# EasyEDA Pro project ProPrj_STM32F103ZET6_2025-04-15.epro, board STM32_PCB
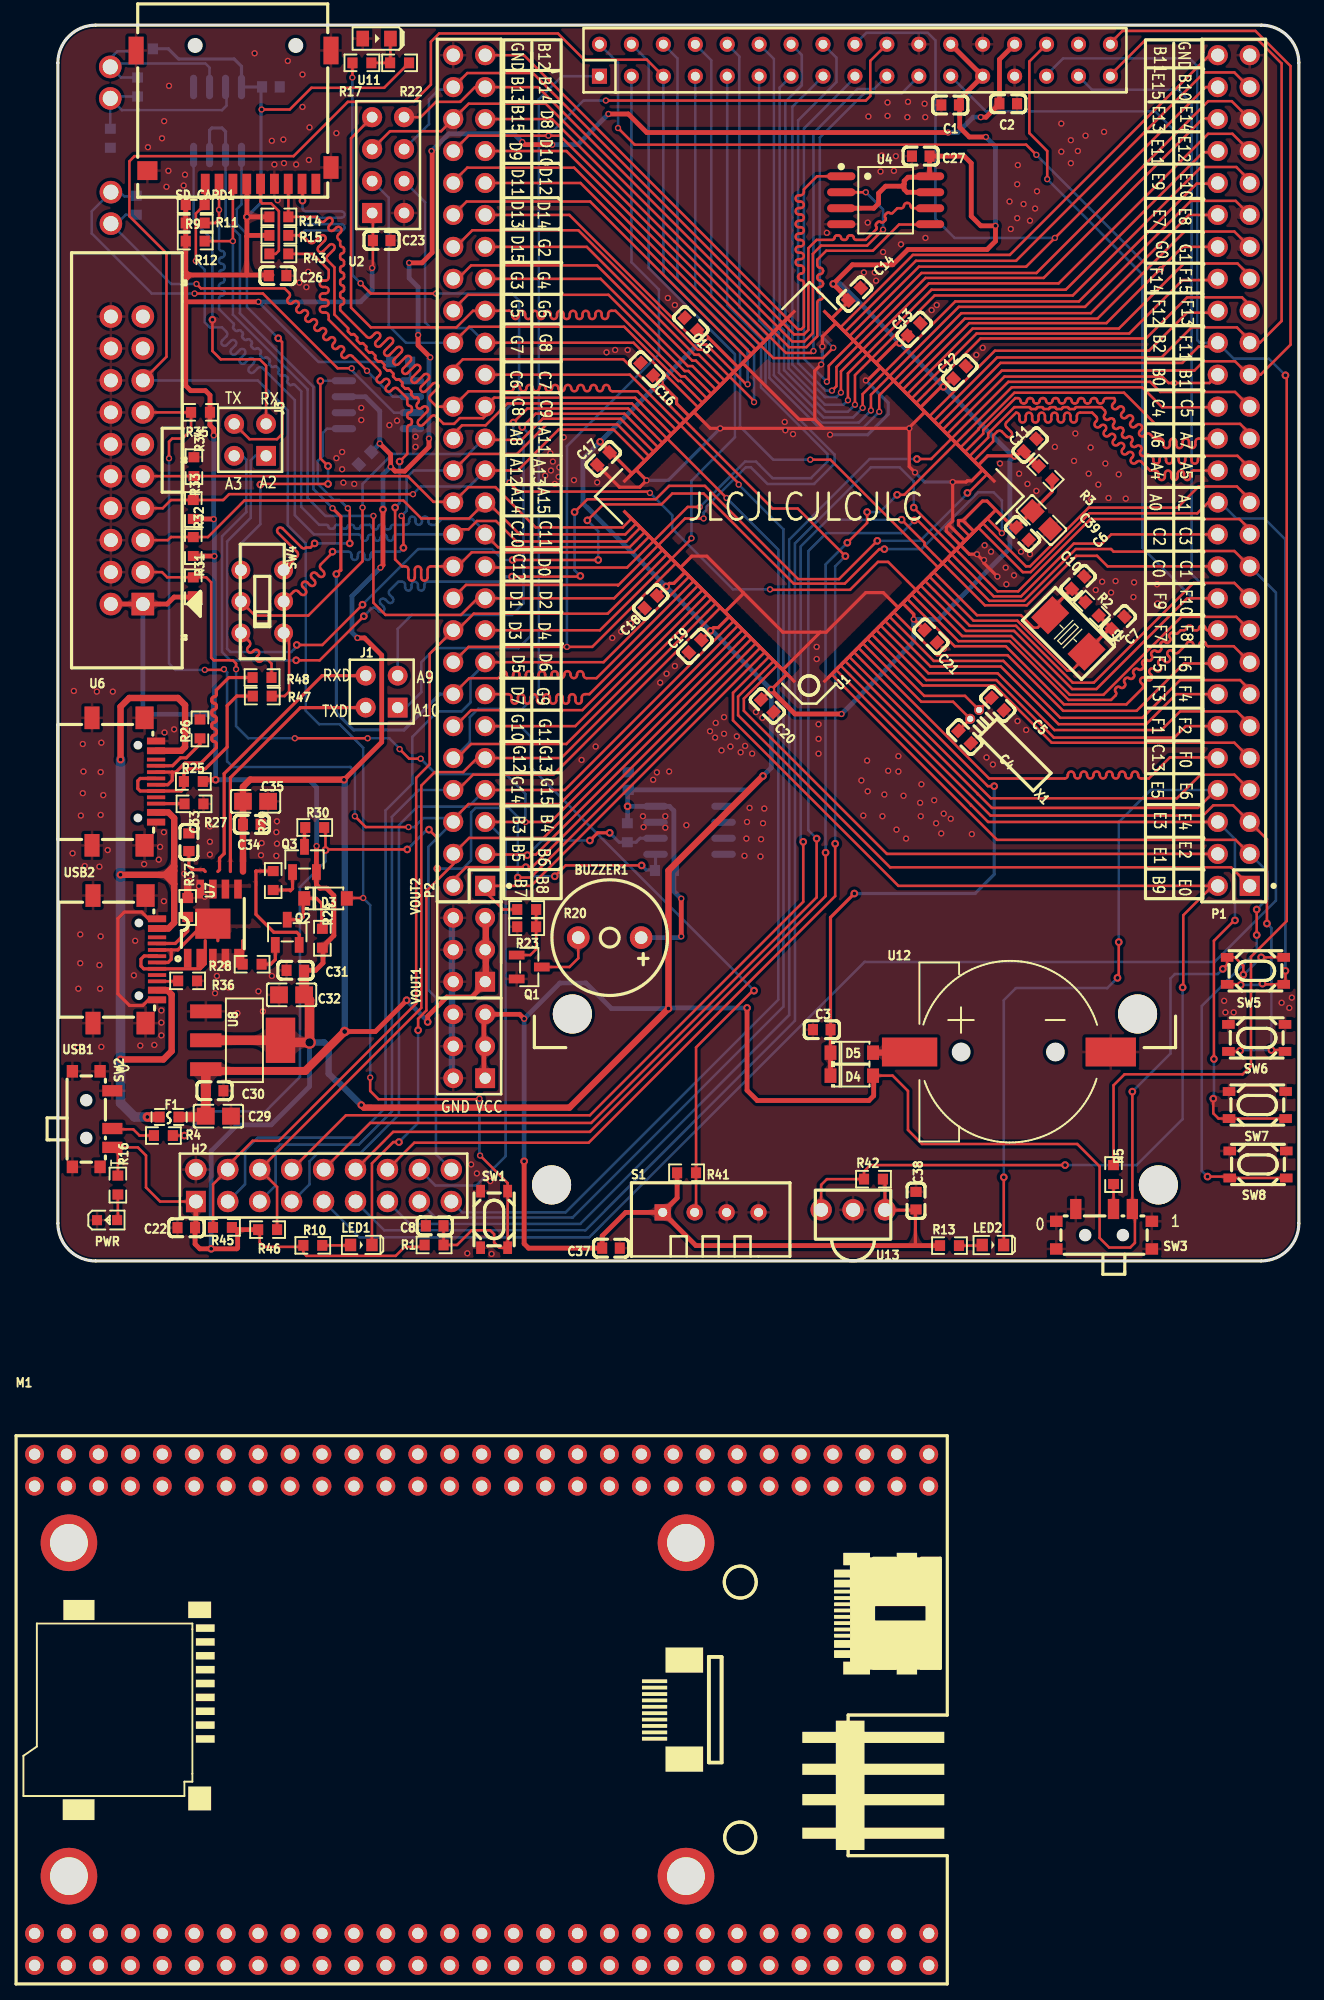
[diagram p6: board, top side]
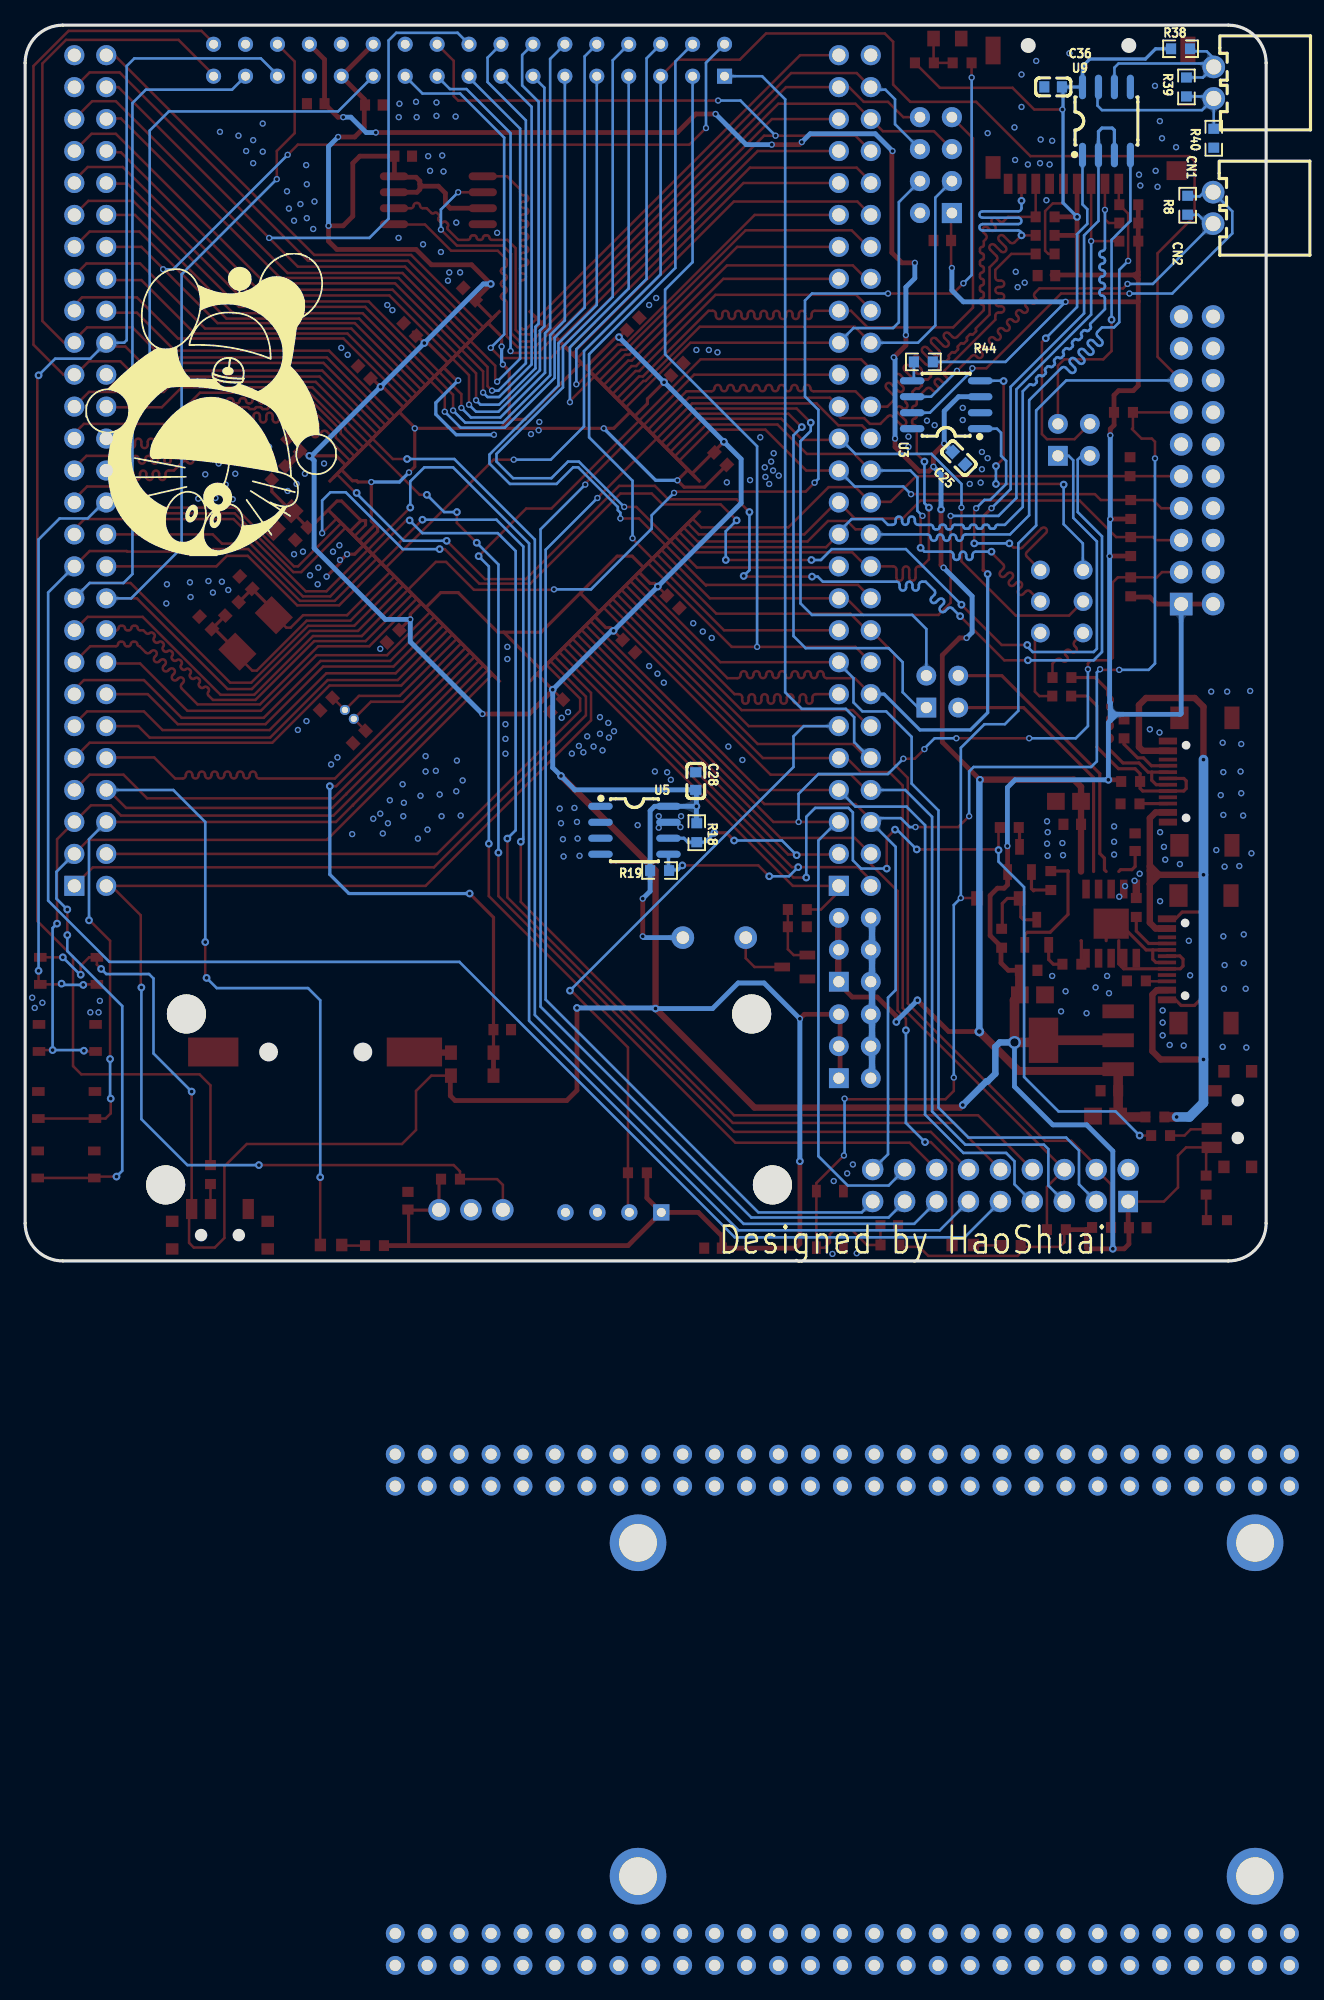
[diagram p7: board, bottom side, seen from below]

Outline 98.7 x 98.25 mm; copper layers: Top Layer, Bottom Layer. Coordinates in mm from the lower left corner of the outline.
Outline path: 0,95.25 0,3 arc(0.88,0.88) 3,0 95.7,0 arc(97.83,0.88) 98.7,3 98.7,95.25 arc(97.83,97.37) 95.7,98.25 3,98.25 arc(0.88,97.37) 0,95.25
Stack: Top Layer 0.035mm - / Dielectric1 1.51mm FR4 er 4.5 / Bottom Layer 0.035mm -

## Design rules (mm)
net PA2: DP4
net PA3: DP4
net PA11: DP3
net PA12: DP3
net D+: DP1
net D-: DP1
net CAN_TX: DP5
net CAN_RX: DP5
net $3N74: DP6
net $3N75: DP6
net $3N43: DP2
net $3N40: DP2
template: JLCPCB Capability(Two Layers Board)
spacing copperThickness1oz (default): track to track 0.102, other pairs 0.152 to 0.3
spacing copperThickness2oz: track to track 0.203, other pairs 0.152 to 0.3
track width copperThickness1oz (default): min 0.127, default 0.254, max 2.54
track width copperThickness2oz: min 0.203, default 0.254, max 2.54
differential pair differentialPair (default): width min 0.127, default 0.254, max 2.54; gap min 0.152, default 0.152
via viaSize (default): diameter min 0.5, default 0.61, max 10; hole min 0.3, default 0.305, max 6.3

## Placement (name value [footprint] x y rotation side)
1  TFTLCD  [TFTLCD_2_4/2_8/3_5]  63.4 51.51 0 top
BUZZER1  3kHz  [BUZ-TH_BD9.0-P5.00-D0.6-FD]  43.89 25.7 180 top
C1  104  [C0603]  70.97 91.9 180 top
C2  104  [C0603]  75.59 92 0 top
C3  104  [C0603]  60.76 18.39 180 top
C4  10P  [C0603]  72.13 41.65 135 top
C5  10P  [C0603]  74.75 44.28 135 top
C6  22P  [C0603]  81.14 53.93 225 top
C7  22P  [C0603]  84.34 50.73 225 top
C8  104  [C0603]  29.97 2.79 180 top
C10  104  [C0603]  76.72 57.82 135 top
C11  0.1u  [C0603]  77.33 64.86 225 top
C12  0.1u  [C0603]  71.73 70.64 225 top
C13  0.1u  [C0603]  68.1 74.05 225 top
C14  0.1u  [C0603]  63.37 76.86 225 top
C15  0.1u  [C0603]  50.35 74.49 315 top
C16  0.1u  [C0603]  46.84 70.89 315 top
C17  0.1u  [C0603]  43.39 63.78 45 top
C18  0.1u  [C0603]  47.16 52.39 45 top
C19  0.1u  [C0603]  50.68 48.87 45 top
C20  0.1u  [C0603]  56.43 44.13 135 top
C21  0.1u  [C0603]  69.43 49.66 135 top
C22  104  [C0603]  10.21 2.64 180 top
C23  104  [C0603]  25.76 81.13 0 top
C25  104  [C0603]  24.44 63.82 225 bottom
C26  104  [C0603]  17.48 78.33 0 top
C27  104  [C0603]  68.63 87.83 0 top
C28  104  [C0603]  45.36 38.15 270 bottom
C29  10u  [C0805]  12.77 11.51 180 top
C30  104  [C0603]  12.47 13.53 0 top
C31  104  [C0603]  18.89 23.11 180 top
C32  10u  [C0805]  18.59 21.15 0 top
C33  104  [C0603]  10.42 33.29 270 top
C34  104  [C0603]  15.42 34.71 180 top
C35  10u  [C0805]  15.72 36.54 0 top
C36  104  [C0603]  16.94 93.34 0 bottom
C37  104  [C0603]  43.99 1.02 180 top
C38  104  [C0603]  68.26 4.79 90 top
C39  10uF  [C0805]  78.23 58.9 315 top
CN1  RS485  [CONN-TH_2P-P2.50_XH-2AW]  4.17 93.68 270 bottom
CN2  CAN  [CONN-TH_2P-P2.50_XH-2AW]  4.22 83.72 270 bottom
D3  1N4148W  [SOD-123_L2.8-W1.8-LS3.7-RD]  21.29 28.82 0 top
D4  DSS14  [SOD-123_L2.8-W1.8-LS3.7-RD]  63.14 14.73 0 top
D5  DSS14  [SOD-123_L2.8-W1.8-LS3.7-RD]  63.14 16.56 0 top
F1  6V1A  [F0603]  8.84 11.45 0 top
H2  OV7670  [HDR-TH_18P-P2.54-V-F-R2-C9-S2.54-1]  21.13 5.99 0 top
J1  USART1  [HDR-M-2.54_2X2]  25.76 45.26 180 top
J3  USART2  [HDR-M-2.54_2X2]  15.29 65.28 180 top
LED1  LED-0603_G  [LED0603_GREEN]  24.13 1.27 0 top
LED2  LED-0603_B  [LED0603_BLUE]  74.37 1.27 0 top
M1  FK103M5  [zet60.11]  -4.77 -59.44 0 top
P1  X6521WV-2×27H-C30D60  [HDR-TH_54P-2.54-V-M-R2-C27-S2.54]  93.52 62.84 90 top
P2  X6521WV-2×27H-C30D60  [HDR-TH_54P-2.54-V-M-R2-C27-S2.54]  32.71 62.84 90 top
PWR  -  [LED_0603]  3.96 3.25 0 top
Q1  SS8050  [SOT-23-3_L2.9-W1.3-P1.90-LS2.4-BR]  37.49 23.37 180 top
Q2  SS8050  [SOT-23-3_L2.9-W1.3-P1.90-LS2.4-BR]  18.24 26.13 270 top
Q3  SS8550  [SOT-23-3_L2.9-W1.3-P1.90-LS2.4-BR]  19.61 31.92 270 top
R1  10K  [R0603]  29.92 1.27 180 top
R2  1M  [R0603]  82.25 51.84 315 top
R3  10R  [R0603]  78.55 62.64 135 top
R4  10K  [R0603]  8.39 9.97 180 top
R5  10K  [R0603]  83.96 6.87 270 top
R8  120R  [R0603]  6.24 83.93 270 bottom
R9  47K  [R0603]  10.92 83.97 180 top
R10  510  [R0603]  20.27 1.24 180 top
R11  47K  [R0603]  10.92 82.52 180 top
R12  47K  [R0603]  10.92 81.08 180 top
R13  510  [R0603]  70.92 1.22 0 top
R14  47K  [R0603]  17.58 83.01 180 top
R15  47K  [R0603]  17.58 81.53 180 top
R16  510  [R0603]  4.77 6.03 270 top
R17  1K  [R0603]  24.18 95.25 0 top
R18  4.7K  [R0603]  45.29 34.05 90 bottom
R19  4.7K  [R0603]  48.24 31.04 0 bottom
R20  1K  [R0603]  37.29 27.94 0 top
R22  47K  [R0603]  27.18 95.25 0 top
R23  10K  [R0603]  37.29 26.57 180 top
R24  10K  [R0603]  21.04 25.65 270 top
R25  1.5K  [R0603]  10.78 38.12 180 top
R26  4.7k  [R0603]  11.3 42.3 270 top
R27  4.7k  [R0603]  10.83 36.34 180 top
R28  1K  [R0603]  15.45 23.59 180 top
R29  1K  [R0603]  17.12 30.24 90 top
R30  1K  [R0603]  20.43 34.46 180 top
R31  10k  [R0603]  10.77 53.59 90 top
R32  10k  [R0603]  10.77 56.79 90 top
R33  10k  [R0603]  10.77 59.74 90 top
R34  10k  [R0603]  10.82 63.14 270 top
R35  10k  [R0603]  11.35 67.46 180 top
R36  4.7k  [R0603]  10.32 22.27 180 top
R37  4.7k  [R0603]  10.33 28.1 270 top
R38  360  [R0603]  6.81 96.37 180 bottom
R39  120  [R0603]  6.34 93.33 270 bottom
R40  360  [R0603]  4.17 89.26 270 bottom
R41  4.7k  [R0603]  50 7.01 180 top
R42  4.7k  [R0603]  64.87 6.5 0 top
R43  100  [R0603]  17.58 80.06 180 top
R44  510  [R0603]  27.26 71.48 0 bottom
R45  4.7k  [R0603]  13.09 2.66 0 top
R46  4.7k  [R0603]  16.68 2.49 180 top
R47  10  [R0603]  16.26 44.91 0 top
R48  10  [R0603]  16.24 46.38 180 top
S1  DHT11_C87032  [SENSOR-TH_DHT11-1]  51.92 3.86 0 top
SD_CARD1  THD2528-11SD-GF  [TF-SMD_THD2528-11SD-GF]  13.97 90.93 180 top
SW1  RST  [SW-SMD_4P-L4.2-W3.2-P2.15-LS4.6]  34.7 3.3 90 top
SW2  BOOT0  [CONN-TH_TA-3524A-A2]  2.74 11.28 90 top
SW3  BOOT1  [CONN-TH_TA-3524A-A2]  83.21 2.54 180 top
SW4  USB/CAN  [SW-TH_6P-L9.1-W3.5-P2.50]  16.26 52.43 270 top
SW5  KEY_UP  [SW-SMD_4P-L4.2-W3.2-P2.15-LS4.6]  95.25 23.06 0 top
SW6  KEY0  [SW-SMD_4P-L4.2-W3.2-P2.15-LS4.6]  95.35 17.73 0 top
SW7  KEY1  [SW-SMD_4P-L4.2-W3.2-P2.15-LS4.6]  95.4 12.4 0 top
SW8  KEY2  [SW-SMD_4P-L4.2-W3.2-P2.15-LS4.6]  95.45 7.67 0 top
U1  STM32F103ZET6  [LQFP144]  61.53 46.65 135 top
U2  -  [NF-01-S]  26.26 87.12 90 top
U3  TJA1050  [SOIC-8_L5.0-W4.0-P1.27-LS6.0-BL]  25.45 68.07 90 bottom
U4  W25Q128  [SOIC-8_L5.3-W5.3-P1.27-LS8.0-BL]  65.84 84.33 270 top
U5  AT24C02  [SOIC-8_L5.0-W4.0-P1.27-LS6.0-BL]  50.24 34.24 270 bottom
U6  JTAG_20  [IDC-TH_20P-P2.54_SAMTEC-HTST-110-01-X-D]  5.49 63.65 90 top
U7  CH340K  [CH340K中央焊盘修改]  13.72 28.21 0 top
U8  AMS1117-3.3_C2992570  [SOT-223-3_L6.4-W3.5-P2.30-LS7.0-BR]  14.74 17.54 180 top
U9  TP8485E-SR  [SOIC-8_L5.0-W4.0-P1.27-LS6.0-BL]  12.7 90.63 180 bottom
U11  0805-PTSM D021  [OPTO-SMD_L2.0-W1.3-RD]  25.35 97.18 180 top
U12  CR1220-A  [BAT-SMD_CR1220-2]  75.74 16.61 0 top
U13  HS0038B  [OPTO-TH_HS0038B-A]  63.25 4.06 180 top
USB1  USB-TTL  [USB-C-SMD_TYPEC-304S-ACP16]  5.34 23.98 270 top
USB2  USB-OTG  [USB-C-SMD_TYPEC-304S-ACP16]  5.26 38.11 270 top
VOUT1  VCC3.3  [HDR-M-2.54_2X3]  33.98 14.53 90 top
VOUT2  VCC5  [HDR-M-2.54_2X3]  33.98 22.2 90 top
X1  32.768KHZ  [OSC-TH_BD2.0-P0.70-D0.3]  72.92 43.45 135 top
X2  8MHz  [CRYSTAL-SMD_L5.0-W3.2]  80.37 49.89 315 top

## Footprints (pads in the part's own frame, mm; a bottom-side part is the same pattern mirrored in y, then rotated)
BAT-SMD_CR1220-2
  rect 4.4x2.3 smd: 1(-8,0)
  rect 4x2.3 smd: 2(8,0)
BUZ-TH_BD9.0-P5.00-D0.6-FD
  round 1.8 hole 1: 1(-2.5,0) 2(2.5,0)
C0603
  rect 0.8x0.9 smd: 1(-0.7,0) 2(0.7,0)
C0805
  rect 1.41x1.35 smd: 1(-1,0) 2(1,0)
CH340K中央焊盘修改
  rect 0.6x1.5 smd: 1(-3.397,-4.147) 2(-2.397,-4.147) 3(-1.397,-4.147) 4(-0.397,-4.147) 5(0.603,-4.147) 6(0.603,1.353) 7(-0.397,1.353) 8(-1.397,1.353) 9(-2.397,1.353) 10(-3.397,1.353)
  rect 2.8x2.4 smd: 11(-1.397,-1.397)
CONN-TH_2P-P2.50_XH-2AW
  round 1.8 hole 1.199: 1(-1.251,0) 2(1.251,0)
CONN-TH_TA-3524A-A2
  rect 0.9x1.6 smd: 1(-2.25,-1.587) 2(-0.75,-1.587) 3(2.25,-1.587)
  rect 1x0.9 smd: 4(-3.8,-0.613) 5(-3.8,1.587) 6(3.8,-0.613) 7(3.8,1.587)
CRYSTAL-SMD_L5.0-W3.2
  rect 1.9x2.4 smd: 1(-2.05,0) 2(2.05,0)
F0603
  rect 0.806x0.864 smd: 1(-0.753,0) 2(0.753,0)
HDR-M-2.54_2X2
  rect 1.575x1.575 hole 0.889: 1(-1.27,1.27)
  round 1.575 hole 0.889: 2(1.27,1.27) 3(-1.27,-1.27) 4(1.27,-1.27)
HDR-M-2.54_2X3
  rect 1.575x1.575 hole 0.889: 1(0,0)
  round 1.575 hole 0.889: 2(0,2.54) 3(2.54,0) 4(2.54,2.54) 5(5.08,0) 6(5.08,2.54)
HDR-TH_18P-P2.54-V-F-R2-C9-S2.54-1
  rect 1.575x1.7 hole 1.1: 1(-10.16,-1.27)
  round 1.7 hole 1.1: 2(-10.16,1.27) 3(-7.62,-1.27) 4(-7.62,1.27) 5(-5.08,-1.27) 6(-5.08,1.27) 7(-2.54,-1.27) 8(-2.54,1.27) 9(0,-1.27) 10(0,1.27) 11(2.54,-1.27) 12(2.54,1.27) 13(5.08,-1.27) 14(5.08,1.27) 15(7.62,-1.27) 16(7.62,1.27) 17(10.16,-1.27) 18(10.16,1.27)
HDR-TH_54P-2.54-V-M-R2-C27-S2.54
  rect 1.6x1.6 hole 1.05: 1(-33.02,-1.27)
  round 1.6 hole 1.05: 2(-33.02,1.27) 3(-30.48,-1.27) 4(-30.48,1.27) 5(-27.94,-1.27) 6(-27.94,1.27) 7(-25.4,-1.27) 8(-25.4,1.27) 9(-22.86,-1.27) 10(-22.86,1.27) 11(-20.32,-1.27) 12(-20.32,1.27) 13(-17.78,-1.27) 14(-17.78,1.27) 15(-15.24,-1.27) 16(-15.24,1.27) 17(-12.7,-1.27) 18(-12.7,1.27) 19(-10.16,-1.27) 20(-10.16,1.27) 21(-7.62,-1.27) 22(-7.62,1.27) 23(-5.08,-1.27) 24(-5.08,1.27) 25(-2.54,-1.27) 26(-2.54,1.27) 27(0,-1.27) 28(0,1.27) 29(2.54,-1.27) 30(2.54,1.27) 31(5.08,-1.27) 32(5.08,1.27) 33(7.62,-1.27) 34(7.62,1.27) 35(10.16,-1.27) 36(10.16,1.27) 37(12.7,-1.27) 38(12.7,1.27) 39(15.24,-1.27) 40(15.24,1.27) 41(17.78,-1.27) 42(17.78,1.27) 43(20.32,-1.27) 44(20.32,1.27) 45(22.86,-1.27) 46(22.86,1.27) 47(25.4,-1.27) 48(25.4,1.27) 49(27.94,-1.27) 50(27.94,1.27) 51(30.48,-1.27) 52(30.48,1.27) 53(33.02,-1.27) 54(33.02,1.27)
IDC-TH_20P-P2.54_SAMTEC-HTST-110-01-X-D
  rect 1.8x1.8 hole 1.1: 1(-11.43,-1.27)
  round 1.8 hole 1.1: 2(-11.43,1.27) 3(-8.89,-1.27) 4(-8.89,1.27) 5(-6.35,-1.27) 6(-6.35,1.27) 7(-3.81,-1.27) 8(-3.81,1.27) 9(-1.27,-1.27) 10(-1.27,1.27) 11(1.27,-1.27) 12(1.27,1.27) 13(3.81,-1.27) 14(3.81,1.27) 15(6.35,-1.27) 16(6.35,1.27) 17(8.89,-1.27) 18(8.89,1.27) 19(11.43,-1.27) 20(11.43,1.27)
LED0603_BLUE
  rect 0.9x1 smd: 1(-0.85,0) 2(0.85,0)
LED0603_GREEN
  rect 0.9x1 smd: 1(-0.85,0) 2(0.85,0)
LED_0603
  rect 0.8x0.8 smd: 1(-0.851,-0.01) 2(0.75,-0.005)
LQFP144
  custom 0.254x1.8 smd: 1(-0.009,0.001) 2(-0.009,-0.499) 3(-0.009,-1) 4(-0.009,-1.5) 5(-0.009,-2) 6(-0.009,-2.499) 7(-0.009,-2.999) 8(-0.009,-3.499) 9(-0.009,-4) 10(-0.009,-4.5) 11(-0.009,-5) 12(-0.009,-5.5) 13(-0.009,-6) 14(-0.009,-6.5) 15(-0.009,-7) 16(-0.009,-7.5) 17(-0.009,-8) 18(-0.009,-8.499) 19(-0.009,-8.999) 20(-0.009,-9.499) 21(-0.009,-9.999) 22(-0.009,-10.499) 23(-0.009,-10.999) 24(-0.009,-11.499) 25(-0.009,-11.999) 26(-0.009,-12.499) 27(-0.009,-13) 28(-0.009,-13.499) 29(-0.009,-13.999) 30(-0.009,-14.499) 31(-0.009,-14.999) 32(-0.009,-15.5) 33(-0.009,-15.999) 34(-0.009,-16.5) 35(-0.009,-17) 36(-0.009,-17.5) 73(22.491,-17.5) 74(22.491,-17) 75(22.491,-16.499) 76(22.491,-15.999) 77(22.491,-15.499) 78(22.491,-14.999) 79(22.491,-14.499) 80(22.491,-13.999) 81(22.491,-13.499) 82(22.491,-12.999) 83(22.491,-12.499) 84(22.491,-11.999) 85(22.491,-11.499) 86(22.491,-10.999) 87(22.491,-10.499) 88(22.491,-9.999) 89(22.491,-9.499) 90(22.491,-8.999) 91(22.491,-8.499) 92(22.491,-8) 93(22.491,-7.499) 94(22.491,-7) 95(22.491,-6.5) 96(22.491,-6) 97(22.491,-5.5) 98(22.491,-5) 99(22.491,-4.5) 100(22.491,-3.999) 101(22.491,-3.499) 102(22.491,-2.999) 103(22.491,-2.499) 104(22.491,-2) 105(22.491,-1.5) 106(22.491,-1) 107(22.491,-0.499) 108(22.491,0.001)
  custom 1.8x0.254 smd: 37(2.491,-20) 38(2.991,-20) 39(3.491,-20) 40(3.991,-20) 41(4.491,-20) 42(4.991,-20) 43(5.491,-20) 44(5.991,-20) 45(6.491,-20) 46(6.991,-20) 47(7.491,-20) 48(7.991,-20) 49(8.491,-20) 50(8.991,-20) 51(9.491,-20) 52(9.991,-20) 53(10.491,-20) 54(10.991,-20) 55(11.491,-20) 56(11.991,-20) 57(12.491,-20) 58(12.991,-20) 59(13.491,-20) 60(13.991,-20) 61(14.491,-20) 62(14.991,-20) 63(15.491,-20) 64(15.991,-20) 65(16.491,-20) 66(16.991,-20) 67(17.491,-20) 68(17.991,-20) 69(18.491,-20) 70(18.991,-20) 71(19.491,-20) 72(19.991,-20) 109(19.991,2.501) 110(19.491,2.501) 111(18.991,2.501) 112(18.491,2.501) 113(17.991,2.501) 114(17.491,2.501) 115(16.991,2.501) 116(16.491,2.501) 117(15.991,2.501) 118(15.491,2.501) 119(14.991,2.501) 120(14.491,2.501) 121(13.991,2.501) 122(13.491,2.501) 123(12.991,2.501) 124(12.491,2.501) 125(11.991,2.501) 126(11.491,2.501) 127(10.991,2.501) 128(10.491,2.501) 129(9.991,2.501) 130(9.491,2.501) 131(8.991,2.501) 132(8.491,2.501) 133(7.991,2.501) 134(7.491,2.501) 135(6.991,2.501) 136(6.491,2.501) 137(5.991,2.501) 138(5.491,2.501) 139(4.991,2.501) 140(4.491,2.501) 141(3.991,2.501) 142(3.491,2.501) 143(2.991,2.501) 144(2.491,2.501)
NF-01-S
  rect 1.6x1.6 hole 0.85: 1(-3.81,1.27)
  round 1.6 hole 0.85: 2(-3.81,-1.27) 3(-1.27,1.27) 4(-1.27,-1.27) 5(1.27,1.27) 6(1.27,-1.27) 7(3.81,1.27) 8(3.81,-1.27)
OPTO-SMD_L2.0-W1.3-RD
  rect 1x1.25 smd: 1(-1.1,0) 2(1.1,0)
OPTO-TH_HS0038B-A
  round 1.7 hole 1.1: 1(2.54,0) 2(0,0) 3(-2.54,0)
OSC-TH_BD2.0-P0.70-D0.3
  round 0.8 hole 0.5: 1(0,0.5) 2(0,-0.5)
R0603
  rect 0.806x0.864 smd: 1(-0.753,0) 2(0.753,0)
SENSOR-TH_DHT11-1
  rect 1.296x1.296 hole 0.711: 1(-3.81,0)
  round 1.296 hole 0.711: 2(-1.27,0) 3(1.27,0) 4(3.81,0)
SOD-123_L2.8-W1.8-LS3.7-RD
  rect 0.95x1.15 smd: 1(-1.692,0) 2(1.692,0)
SOIC-8_L5.0-W4.0-P1.27-LS6.0-BL
  oval 0.569x1.95 smd: 1(-1.905,-2.705) 2(-0.635,-2.705) 3(0.635,-2.705) 4(1.905,-2.705) 5(1.905,2.705) 6(0.635,2.705) 7(-0.635,2.705) 8(-1.905,2.705)
SOIC-8_L5.3-W5.3-P1.27-LS8.0-BL
  oval 0.63x2.25 smd: 1(-1.905,-3.53) 2(-0.635,-3.53) 3(0.635,-3.53) 4(1.905,-3.53) 5(1.905,3.53) 6(0.635,3.53) 7(-0.635,3.53) 8(-1.905,3.53)
SOT-23-3_L2.9-W1.3-P1.90-LS2.4-BR
  rect 1.25x0.7 smd: 1(1,-0.95) 2(1,0.95) 3(-1,0)
SOT-223-3_L6.4-W3.5-P2.30-LS7.0-BR
  rect 2.5x1.1 smd: 1(2.97,-2.3) 2(2.97,0) 3(2.97,2.3)
  rect 2.34x3.6 smd: 4(-2.97,0)
SW-SMD_4P-L4.2-W3.2-P2.15-LS4.6
  rect 1x0.7 smd: 1(-2.25,1.075) 2(2.25,1.075) 3(-2.25,-1.075) 4(2.25,-1.075)
SW-TH_6P-L9.1-W3.5-P2.50
  round 1.5 hole 0.95: 1(-2.5,-1.7) 2(0,-1.7) 3(2.5,-1.7) 4(2.5,1.7) 5(0,1.7) 6(-2.5,1.7)
TF-SMD_THD2528-11SD-GF
  rect 0.7x1.6 smd: 1(2.25,5.3) 2(1.15,5.3) 3(0.05,5.3) 4(-1.05,5.3) 5(-2.15,5.3) 6(-3.25,5.3) 7(-4.35,5.3) 8(-5.45,5.3) 9(-6.55,5.3)
  rect 1.2x1.8 smd: 10(-7.75,4)
  rect 1.2x2.2 smd: 11(-7.75,-5.3) 12(7.75,-5.3)
  rect 1.6x1.5 smd: 13(6.85,4.25)
TFTLCD_2_4/2_8/3_5
  rect 1.2x1.2 hole 0.705x0.7: 1(-20.322,42.678)
  round 1.2 hole 0.705x0.7: 2(-20.322,45.218) 3(-17.782,42.678) 4(-17.782,45.218) 5(-15.24,42.672) 6(-15.242,45.218) 7(-12.7,42.672) 8(-12.7,45.212) 9(-10.162,42.678) 10(-10.162,45.218) 11(-7.622,42.678) 12(-7.622,45.218) 13(-5.082,42.678) 14(-5.082,45.218) 15(-2.542,42.678) 16(-2.542,45.218) 17(-0.002,42.678) 18(-0.002,45.218) 19(2.538,42.678) 20(2.538,45.218) 21(5.078,42.678) 22(5.078,45.218) 23(7.618,42.678) 24(7.618,45.218) 25(10.158,42.678) 26(10.158,45.218) 27(12.698,42.678) 28(12.698,45.218) 29(15.238,42.678) 30(15.238,45.218) 31(17.778,42.678) 32(17.778,45.218) 33(20.318,42.678) 34(20.318,45.218)
  round 3.1 hole 3.1: 35(24.13,-45.466) 36(-22.479,-31.877) 37(22.479,-31.877) 38(-24.13,-45.466)
USB-C-SMD_TYPEC-304S-ACP16
  rect 1.8x1.45 smd: 13(-5.07,1.633) 14(5.07,1.633)
  rect 1.8x1.2 smd: 15(-5.07,-2.547) 16(5.07,-2.547)
  rect 0.55x1.45 smd: A1B12(-3.225,2.547) A4B9(-2.45,2.547) B1A12(3.22,2.547) B4A9(2.45,2.547)
  rect 0.3x1.45 smd: A5(-1.26,2.533) A6(-0.25,2.547) A7(0.25,2.547) A8(1.25,2.547) B5(1.75,2.547) B6(0.75,2.547) B7(-0.75,2.547) B8(-1.75,2.547)
zet60.11
  round 4.5 hole 3.005x3: 0(5.654,37.029) 0(5.654,10.525) 0(54.733,37.029) 0(54.733,10.525)
  round 1.5 hole 0.9: 1(74.041,44.069) 2(74.041,41.529) 3(71.501,44.069) 4(71.501,41.529) 5(68.961,44.069) 6(68.961,41.529) 7(66.421,44.069) 8(66.421,41.529) 9(63.881,44.069) 10(63.881,41.529) 11(61.341,44.069) 12(61.341,41.529) 13(58.801,44.069) 14(58.801,41.529) 15(56.261,44.069) 16(56.261,41.529) 17(53.721,44.069) 18(53.721,41.529) 19(51.181,44.069) 20(51.181,41.529) 21(48.641,44.069) 22(48.641,41.529) 23(46.101,44.069) 24(46.101,41.529) 25(43.561,44.069) 26(43.561,41.529) 27(41.021,44.069) 28(41.021,41.529) 29(38.481,44.069) 30(38.481,41.529) 31(35.941,44.069) 32(35.941,41.529) 33(33.401,44.069) 34(33.401,41.529) 35(30.861,44.069) 36(30.861,41.529) 37(28.321,44.069) 38(28.321,41.529) 39(25.781,44.069) 40(25.781,41.529) 41(23.241,44.069) 42(23.241,41.529) 43(20.701,44.069) 44(20.701,41.529) 45(18.161,44.069) 46(18.161,41.529) 47(15.621,44.069) 48(15.621,41.529) 49(13.081,44.069) 50(13.081,41.529) 51(10.541,44.069) 52(10.541,41.529) 53(8.001,44.069) 54(8.001,41.529) 55(5.461,44.069) 56(5.461,41.529) 57(2.921,44.069) 58(2.921,41.529) 59(74.041,5.969) 60(74.041,3.429) 61(71.501,5.969) 62(71.501,3.429) 63(68.961,5.969) 64(68.961,3.429) 65(66.421,5.969) 66(66.421,3.429) 67(63.881,5.969) 68(63.881,3.429) 69(61.341,5.969) 70(61.341,3.429) 71(58.801,5.969) 72(58.801,3.429) 73(56.261,5.969) 74(56.261,3.429) 75(53.721,5.969) 76(53.721,3.429) 77(51.181,5.969) 78(51.181,3.429) 79(48.641,5.969) 80(48.641,3.429) 81(46.101,5.969) 82(46.101,3.429) 83(43.561,5.969) 84(43.561,3.429) 85(41.021,5.969) 86(41.021,3.429) 87(38.481,5.969) 88(38.481,3.429) 89(35.941,5.969) 90(35.941,3.429) 91(33.401,5.969) 92(33.401,3.429) 93(30.861,5.969) 94(30.861,3.429) 95(28.321,5.969) 96(28.321,3.429) 97(25.781,5.969) 98(25.781,3.429) 99(23.241,5.969) 100(23.241,3.429) 101(20.701,5.969) 102(20.701,3.429) 103(18.161,5.969) 104(18.161,3.429) 105(15.621,5.969) 106(15.621,3.429) 107(13.081,5.969) 108(13.081,3.429) 109(10.541,5.969) 110(10.541,3.429) 111(8.001,5.969) 112(8.001,3.429) 113(5.461,5.969) 114(5.461,3.429) 115(2.921,5.969) 116(2.921,3.429)

## Nets
As in the schematic.

Pads without a net: 1 32 35 36 37 38; M1 0; SD_CARD1 9; U1 106; U6 11 17 19; U7 5 11; USB1 A8 B8; USB2 A8 B8

## Via types
v1: diameter 0.5, hole 0.3, Top Layer to Bottom Layer, 317 vias
v2: diameter 0.5, hole 0.299, Top Layer to Bottom Layer, 45 vias
v3: diameter 0.61, hole 0.305, Top Layer to Bottom Layer, 108 vias
v4: diameter 1.016, hole 0.66, Top Layer to Bottom Layer, 1 via
v5: diameter 0.762, hole 0.381, Top Layer to Bottom Layer, 1 via

## Routing (per net, layer and track width the routed paths; a pad name or vN(x,y) marks a point on that pad's centre or on a via; arc(x,y) is an arc through that point)
GND: length 136.2
  Top Layer w0.254: U1.31 70.89,58.5 70.85,58.5 ; 70.85,58.5 70.66,58.32 70.66,58.02 72.5,56.18 v1(73.1,56.18) 73.56,55.73 v1(73.66,55.73) 73.66,55.47 v1(74.73,54.41) ; 70.85,58.5 71.17,58.83 v2(71.17,61.92) 72.24,61.92 72.34,62.03 72.68,62.03 U1.38 ; 7.89,20.76 7.21,20.76 6.76,20.31 5.7,20.31 4.78,21.23 4.78,27.23 5.28,27.74 6.67,27.74 7.2,27.2 7.89,27.2 ; U1.107 v2(46.83,62.06) 46.29,61.52 44.66,61.52 42.89,63.29 ; U1.94 51.88,66.19 v2(52.68,66.19) 60.91,66.19 ; 54.52,53.13 57.66,49.99 60.64,49.99 ; 54.52,53.13 54.52,53.06 53.05,51.59 ; 54.52,53.13 51.61,56.03 50.42,56.03 U1.120 ; v2(68.17,62.69) 67.72,63.14 v1(67.72,66.19) ; 60.64,49.99 61.11,49.99 64.26,53.14 65.65,53.14 U1.16 ; 60.64,49.99 57.65,46.99 ; 60.2,66.9 58.95,66.9 U1.83 ; 60.2,66.9 60.91,66.19 ; 60.2,66.9 60.2,70.76 v1(60.71,71.27) ; v1(67.72,66.19) 67.72,66.26 U1.51 ; v1(67.72,66.19) 60.91,66.19 ; v1(64.26,70) 64.39,70 65.42,71.03 ; U1.71 60.81,73.49 v2(60.81,72.69)
  Bottom Layer w0.254: v2(60.81,72.69) 60.81,71.37 v1(60.71,71.27) ; v2(61.42,65.68) 64.41,65.68 66.04,67.31 66.04,68.22 v1(64.26,70) ; v2(71.17,61.92) 68.94,61.92 v2(68.17,62.69) ; v2(46.83,62.06) 48.55,62.06 v2(52.68,66.19)
  Bottom Layer w0.508: 31.34,26.97 31.34,14.22
  vias: v1(1.17,32.41) v1(1.27,45.31) v1(1.58,16.97) v1(1.63,21.64) v1(1.78,25.96) v1(1.78,23.67) v1(1.83,35.41) v1(1.98,41.1) v1(1.98,37.19) v1(2.03,38.91) v1(2.13,31.39) v1(3.1,45.26) v1(3.3,31.34) v1(3.3,23.52) v1(3.35,21.64) v1(3.45,41.2) v1(3.4,38.86) v1(3.4,35.46) v1(3.4,25.81) v1(3.45,17.02) v1(3.61,37.03) v1(3.96,32.66) v1(4.37,45.26) v1(6.05,22.71) v1(6.15,25.45) v1(6.55,17.12) v1(6.86,31.55) v1(7.16,88.54) v1(7.67,17.17) v1(8.03,31.9) v1(8.13,32.92) v1(8.28,89.26) v1(8.23,19.91) v1(8.23,18.95) v1(8.23,17.93) v1(8.45,90.62) v1(8.48,42.01) v1(8.43,34.09) v1(8.43,28.6) v1(8.64,85.39) v1(8.79,86.66) v1(8.84,93.42) v1(9.25,42.27) v1(10.01,85.5) v1(10.06,30.78) v1(10.11,86.36) v1(10.47,30.23) v1(11.22,29.8) v1(11.68,28.96) v1(12.09,34.54) v1(12.09,33.32) v1(12.09,32.31) v1(12.5,21.28) v1(12.65,22.66) v1(13.56,21.74) v1(14.28,19.7) v1(15.65,96.01) v1(15.95,21.44) v1(16.15,32.26) v1(16.2,33.22) v1(16.31,19.84) v1(17.02,89.05) v1(17.02,22.66) v1(17.22,87.17) v1(17.37,34.09) v1(17.37,32.21) v1(17.48,84.33) v1(17.42,34.95) v1(17.42,33.17) v1(17.93,89.15) v1(17.98,87.27) v1(18.29,95.4) v1(18.95,87.17) v1(19.2,77.77) v1(19.46,94.32) v1(19.46,91.74) v1(19.76,77.42) v1(19.96,87.53) v1(19.91,78.64) v1(20.02,90.12) v1(22.15,89.66) v1(22.15,63.83) v1(22.61,64.31) v1(22.61,62.94) v1(22.71,61.87) v1(23.57,61.77) v1(24.13,67.82) v1(24.13,66.85) v1(26.37,66.45) v1(26.98,66.8) v1(28.45,65.53) v1(28.45,64.72) v1(32.56,0.61) v1(32.87,7.67) v1(33.33,6.96) v1(34.39,6.35) v1(34.49,0.56) v1(38.76,62.43) v1(39.17,64.21) v1(39.22,62.84) v1(39.37,63.55) v1(39.52,61.77) v1(39.88,63.09) v1(39.83,62.33) v1(40.23,65.48) v1(41.05,62.08) v1(41.66,39.83) v1(42.77,40.89) v1(42.89,61.9) v1(43.64,72.24) v1(44.09,49.53) v1(44.32,72.42) v1(44.81,50.04) v1(45.32,72.42) v1(45.57,50.7) v1(46.53,35.36) v1(46.58,34.49) v1(47.35,38.25) v1(47.64,38.85) v1(47.9,45.97) v1(48.31,35.36) v1(48.31,34.44) v1(48.41,46.69) v1(48.51,76.56) v1(48.62,38.91) v1(49.07,76) v1(49.07,47.29) v1(49.99,34.65) v1(51.87,42.11) v1(52.27,41.61) v1(52.32,42.77) v1(52.78,40.59) v1(52.98,43.23) v1(52.98,41.91) v1(53.49,40.89) v1(54,41.71) v1(54.3,40.44) v1(54.66,40.94) v1(54.61,32.21) v1(54.76,33.58) v1(54.81,34.9) v1(55.02,36.02) v1(55.22,40.34) v1(55.52,43.64) v1(55.88,32.16) v1(55.93,33.53) v1(56.03,43.18) v1(56.08,34.8) v1(56.19,35.97) v1(57.81,66.7) v1(57.86,66.04) v1(58.47,65.73) v1(60.35,48.82) v1(60.35,47.85) v1(60.5,42.67) v1(60.5,41.5) v1(60.5,40.33) v1(61.16,81.74) v1(63.91,38.2) v1(64.06,35.41) v1(64.11,78.59) v1(64.36,39.78) v1(64.46,90.98) v1(64.41,82.55) v1(64.41,37.34) v1(64.97,78.59) v1(65.08,77.93) v1(65.43,86.61) v1(65.53,87.88) v1(65.58,35.36) v1(65.63,80.21) v1(65.73,37.08) v1(65.99,92.1) v1(65.99,91.03) v1(66.04,38.96) v1(66.5,86.66) v1(66.65,87.83) v1(66.7,34.29) v1(66.85,40.13) v1(66.85,38.91) v1(67.06,80.82) v1(67.26,36.98) v1(67.46,33.58) v1(67.56,90.93) v1(67.61,92.15) v1(68.58,36.42) v1(68.68,37.9) v1(68.63,35.36) v1(68.94,92) v1(68.99,90.93) v1(69,81.33) v1(69.49,75.59) v1(69.7,36.63) v1(69.85,34.8) v1(69.9,76) v1(70.26,33.98) v1(70.46,48.67) v1(70.46,35.56) v1(71.02,35.15) v1(72.7,33.93) v1(73.05,72.03) v1(73.56,72.59) v1(73.71,56.9) v1(73.86,40.03) v1(74.22,56.39) v1(74.37,39.47) v1(74.93,63.4) v1(75.39,55.12) v1(75.44,53.8) v1(75.69,84.23) v1(75.79,82.04) v1(76.05,54.51) v1(76.35,87.12) v1(76.3,85.6) v1(76.3,82.91) v1(76.33,42.92) v1(76.45,62.59) v1(76.61,56.39) v1(76.81,84.02) v1(77.01,42.21) v1(77.11,61.77) v1(77.32,82.7) v1(77.32,56.18) v1(77.72,83.67) v1(77.88,85.04) v1(77.83,61.21) v1(79.3,64.72) v1(79.81,90.42) v1(79.81,88.19) v1(80.57,89.1) v1(80.57,87.27) v1(80.82,63.6) v1(80.92,65.79) v1(81.13,88.24) v1(81.74,89.46) v1(81.99,62.59) v1(82.14,64.67) v1(82.19,60.55) v1(82.55,53.34) v1(82.75,61.72) v1(83.06,54) v1(83.21,89.76) v1(83.31,63.4) v1(83.57,60.66) v1(83.77,53.14) v1(84.13,54.05) v1(84.38,62.53) v1(84.94,60.6) v1(85.55,52.78) v1(85.6,53.95) v1(87.43,53.8) v1(87.48,52.27) v1(92.76,20.68) v1(92.86,19.76) v1(93.52,19.76) v1(97.33,20.52) v1(97.94,20.12) v1(98.15,20.93)
VBAT_IN: length 49.6
  Top Layer w0.203: v3(74.47,37.74) 73.97,37.74 U1.6
  Top Layer w0.254: D5.1 61.45,27.31 v3(63.35,29.21)
  Top Layer w0.381: D4.1 D5.1
  Bottom Layer w0.254: v3(63.35,29.21) 72.95,29.21 74.47,30.73 v3(74.47,37.74)
VCC3.3: length 724.1
  Top Layer w0.203: v3(51.9,50.1) C19.2 ; D4.2 66.4,14.73 67.61,13.51 67.61,10.41 68.73,9.3 81.08,9.3 82.86,7.52 82.86,1.83 83.62,1.07 85.29,1.07 85.66,1.44 85.66,3.57 85.46,3.78 SW3.1 v3(85.46,13.46) ; v3(56.74,45.42) 55.96,44.63 C20.2 ; R1.2 29.02,1.12 27.58,1.12 26.87,0.4 19.77,0.4 19.52,0.65 R10.2 19.4,1.12 16.41,1.12 16.05,1.47 16.05,2.36 15.93,2.49 ; v3(92.66,23.22) 93,23.56 SW5.1 93.62,24.14 94.29,23.47 v3(94.29,22.76) ; v1(24.99,78.94) 25.06,79 C23.1 25.06,83.25 U2.1 ; 95.71,24.13 v3(95.71,24.14) SW5.2 ; R16.1 4.77,8.59 SW2.1 6.37,9.03 7.01,8.38 7.01,5.84 8.13,4.72 H2.1 ; v2(16.2,91.54) 18.44,91.54 20.17,93.27 25.95,93.27 R22.2 ; v3(48.38,53.62) C18.2
  Top Layer w0.254: v3(43.13,65.13) 45.63,62.63 U1.108 ; U1.39 73.95,64.01 v3(76.1,64.01) 76.27,64.01 76.68,64.42 ; U1.52 70.25,69.49 v3(70.44,69.49) 71.17,70.22 71.17,70.23 ; v3(51.9,50.1) 52.15,50.35 52.51,50.35 U1.131 ; 49.87,54.77 49.87,54.74 48.99,53.87 48.63,53.87 v3(48.38,53.62) ; v3(56.74,45.42) 57.97,46.64 U1.144 ; 50.22,67.15 49.21,68.16 49.21,68.53 v3(47.89,69.86) 47.34,70.4 47.33,70.4 ; U1.72 62.87,76.26 C14.2 62.87,76.47 ; 68.21,4.04 C38.1 ; 68.21,4.04 68.21,1.26 68.16,1.22 ; 68.21,4.04 65.81,4.04 U13.3 65.79,6.34 R42.2 ; U1.84 51.7,73.44 v3(51.47,73.44) 50.92,74 C15.2 ; U1.62 66.66,72.97 v3(66.96,72.97) 66.96,72.98 67.83,73.86 ; U1.17 68.07,51.42 v1(68.07,51) 68.09,51 C21.2
  Top Layer w0.381: 15.02,78.38 17.03,78.38 ; 15.02,78.38 15.02,81.46 15.04,81.48 ; 15.02,78.38 10.52,78.38 ; v3(54.81,20.12) 54.81,13.56 55.63,12.75 64.51,12.75 64.89,13.13 64.89,14.53 64.99,14.63 ; v1(12.45,56.03) 12.44,56.04 R32.1 ; C31.1 20.5,23.11 21.09,23.69 21.09,24.8 20.99,24.9 21.95,25.86 21.95,29.05 21.37,29.63 20.83,29.63 20.56,29.9 Q3.2 20.56,32.97 v1(20.58,32.99) ; 15.04,81.48 15.09,81.53 R15.2 ; 15.04,81.48 v3(15.04,83.01) ; v2(49.58,28.8) v2(49.58,25.81) ; v1(73.81,89.36) 72.49,89.36 71.73,90.12 71.73,92.36 1.25 1.24 ; v3(37.08,7.92) 37.08,1.37 37.44,1.02 43.29,1.02 43.29,1.99 45.16,3.86 S1.1 ; 10.52,78.38 10.17,78.04 ; 10.52,78.38 10.41,78.38 10.17,78.63 ; 10.17,78.04 10.17,76.28 ; 10.17,78.04 10.17,78.37 ; 10.17,76.28 10.17,69.59 10.57,69.19 11.73,69.19 12.1,68.83 12.1,67.46 12.09,67.45 12.09,66.45 12.39,66.14 v1(12.39,65.63) ; 10.17,76.28 10.2,76.25 v1(15.95,76.25) ; H2.1 10.97,2.7 C22.1 10.91,1.34 11.29,0.97 v3(12.19,0.97) 14.22,0.97 14.3,1.04 14.3,2.51 14.32,2.49 15.93,2.49 ; 67.31,85.63 67.31,85.85 67.61,86.16 69.22,86.16 69.33,86.27 ; 67.31,85.63 67.13,85.45 65.84,85.45 65.28,84.89 65.28,84.07 64.9,83.69 62.31,83.69 ; 67.31,85.63 67.31,85.19 67.54,84.96 U4.7 ; v3(56.74,45.42) 56.74,45.36 58.62,43.48 v1(62.33,43.48) ; 69.33,86.27 C27.2 72.08,87.83 72.64,87.27 72.64,83.06 73.41,82.3 v1(74.57,82.3) 74.57,81.08 73.91,80.42 67.61,80.42 66.4,79.2 63.2,79.2 v3(61.67,77.67) 62.87,76.47 ; 69.33,86.27 U4.8 ; 10.17,78.63 R11.2 ; 10.17,78.63 10.17,78.37 ; R33.1 12.38,58.99 v1(12.39,58.97) ; 10.17,78.37 10.16,78.38 ; SD_CARD1.4 15.04,85.61 v3(15.04,83.01) ; R13.1 50.75,1.22 S1.1 ; R41.2 49.25,5 S1.1 ; 33.88,14.22 33.88,19.61 36.73,19.61 v1(37.08,19.25) ; v3(15.04,83.01) R14.2 ; U6.2 U6.1 8.69,52.22 9.25,52.78 10.71,52.78 R31.1 ; R9.2 10.17,82.52 ; 11.53,38.22 11.56,38.25 v3(12.55,38.25)
  Top Layer w0.508: 76.68,64.42 77.93,63.17 R3.2 ; v3(56.08,38.56) 48.57,31.04 v3(48.57,20.07) 40.69,12.19 24.33,12.19 v3(24.13,12.4)
  Top Layer w0.762: U8.2 U8.4 17.88,17.37 v4(20.02,17.37) 20.02,20.72 C32.2 C31.1
  Bottom Layer w0.203: v3(95.71,24.14) 94.33,22.76 v3(94.29,22.76) ; v1(15.95,76.25) 20.73,71.48 R44.1 ; 16.15,93.19 16.01,93.33 ; v3(92.66,23.22) 92.25,22.81 88.85,22.81 88.49,22.45 88.49,16.5 v3(85.46,13.46) ; v2(16.2,91.54) 16.19,91.54 16.15,91.57
  Bottom Layer w0.254: 16.09,93.54 16.15,93.48 16.15,84.12 v3(15.04,83.01) ; R38.1 8.79,96.37 9.6,95.55 14.02,95.55 14.61,94.97 U9.8 16.01,93.33
  Bottom Layer w0.381: v1(20.58,32.99) 20.58,37.64 19.96,38.25 v3(12.55,38.25) 12.55,42.8 12.4,42.94 ; 12.39,44.37 12.45,44.42 v1(12.45,56.03) 12.45,58.92 v1(12.39,58.97) v1(12.39,65.63) ; 12.39,44.37 12.39,43.84 12.02,43.46 11.89,43.46 ; 12.39,44.37 12.4,44.37 12.4,42.94 ; R18.2 45.31,34.82 v3(45.31,36.14) ; 11.89,43.46 6.83,43.46 6.76,43.54 U6.1 ; 11.89,43.46 12.4,42.94 ; v4(20.02,17.37) 20.02,13.87 16.97,10.82 14.28,10.82 12.19,8.74 v3(12.19,0.97) ; v3(51.47,73.44) v3(47.89,69.86) 47.86,69.86 v3(43.13,65.13) 41.76,63.75 41.76,60.24 v3(48.38,53.62) v3(51.9,50.1) 52.06,50.1 v3(56.74,45.42) 56.74,39.22 v3(56.08,38.56) 54.98,37.45 C28.2 45.31,37.4 v3(45.31,36.14) ; v2(49.58,25.81) 49.48,25.7 BUZZER1.1 ; v3(45.31,36.14) U5.8 48.64,36.14 49,35.79 R19.2 49,29.39 v2(49.58,28.8) ; v1(24.99,78.94) 24.99,77.17 24.08,76.25 v1(15.95,76.25) ; v1(73.81,89.36) 74.57,88.59 v1(74.57,82.3) ; v3(61.67,77.67) 62.26,77.67 v3(66.96,72.97) v3(70.44,69.49) 75.92,64.01 v3(76.1,64.01) 75.72,63.63 75.72,56.67 70.05,51 v1(68.07,51) 68.07,49.23 v1(62.33,43.48) ; v3(54.81,20.12) 48.62,20.12 v3(48.57,20.07) 44.03,20.07 42,22.1 39.93,22.1 v1(37.08,19.25) v3(37.08,7.92)
  Bottom Layer w0.508: v3(24.13,12.4) 22.25,14.27 22.15,14.27 21.54,14.88 21.54,17.02 21.18,17.37 v4(20.02,17.37)
VCC5: length 194.2
  Top Layer w0.381: v1(25.6,64.98) 26.47,64.12 v1(26.47,63.14) 26.82,62.79 27.58,62.79 29.52,64.72 v2(29.52,65.38) ; v2(36.93,88.95) 37.14,88.75 v2(39.32,88.75) ; v2(70.82,89.71) 46.84,89.71 45.36,91.19 v1(43.79,91.19) ; v3(27.74,20.73) 25.25,18.24 v5(22.81,18.24) ; v2(29.72,88.24) 29.77,88.19 29.77,80.16 28.96,79.35 v2(27.94,79.35) ; v3(25.86,59.74) 25.86,55.32 v2(25.65,55.12) ; v2(28.65,73.61) 28.65,72.8 v2(29.62,71.83) ; v2(73.41,90.93) 73.82,90.93 C2.1 74.89,95.52 1.28 ; 33.88,21.89 33.83,21.89 32.92,20.98 30.94,20.98 29.41,19.46 v3(29.41,19) ; v3(22.76,38.25) 25.76,41.25 25.76,48.16 24.38,49.53 v1(23.83,49.53)
  Top Layer w0.508: 33.83,21.89 34.04,22.1 34.04,26.97 33.83,26.97 ; 14.72,30.96 C34.2 C35.1 14.72,37.69 15.3,38.27 22.56,38.27
  Top Layer w0.635: v5(22.81,18.24) 19.68,15.1 11.91,15.1 U8.3
  Top Layer w0.762: U8.3 C30.1 C29.2 11.7,11.45 F1.2
  Bottom Layer w0.381: v2(27.94,79.35) 27.94,78.13 28.65,77.42 v2(28.65,73.61) ; v1(23.83,49.53) 23.38,49.97 23.38,52.85 v2(25.65,55.12) ; v2(29.52,65.38) 29.52,71.73 v2(29.62,71.83) ; C25.1 v1(25.6,64.98) 25.6,67.56 24.46,68.71 U3.3 ; v1(43.79,91.19) 41.35,88.75 v2(39.32,88.75) ; v2(70.82,89.71) 71.58,89.71 72.8,90.93 v2(73.41,90.93) ; v3(29.41,19) 29.41,19.05 v3(27.74,20.73) ; v3(25.86,59.74) 25.86,62.53 v1(26.47,63.14) ; v2(36.93,88.95) 36.27,89.61 31.09,89.61 v2(29.72,88.24)
  Bottom Layer w0.508: v5(22.81,18.24) 22.81,38.2 v3(22.76,38.25)
VDDA: length 14.1
  Top Layer w0.203: 71.63,58.5 72.5,57.63 U1.32
  Top Layer w0.254: U1.33 72.85,58 71.99,58.86 ; 71.63,58.5 71.63,58.86 71.99,58.86 ; 71.99,58.86 73.54,60.41 73.9,60.41 76.06,58.26 76.29,58.26 76.29,58.37 C39.1 79.08,61.17 79.08,62.11
1WIRE_DQ: length 73.2
  Top Layer w0.203: P2.11 41.15,42.52 U1.126 ; v3(55.37,21.49) 55.27,21.49 50.76,16.98 R41.1 50.76,3.97 S1.2
  Bottom Layer w0.203: v3(55.37,21.49) 37.59,39.27 37.59,41.71 36.78,42.52 P2.11
BEEP: length 33.5
  Top Layer w0.203: U1.139 37.64,29.82 P2.1 34.04,29.77 34.04,29.31 35.41,27.94 R20.1
BOOT0: length 87.4
  Top Layer w0.203: v3(36.58,30.48) 37.6,30.48 U1.138 ; v3(27.79,32.72) 21.34,32.72 v3(21.28,32.66) 21.28,34.35 R30.1 ; v3(29.52,34.29) 30.17,33.63 v3(30.17,31.19) ; 9.15,9.97 v3(10.06,9.97)
  Bottom Layer w0.203: v3(10.06,9.97) 11.98,11.89 16.51,11.89 19.25,14.63 19.25,29.72 21.28,31.75 v3(21.28,32.66) ; v3(29.52,34.29) 29.36,34.29 v3(27.79,32.72) ; v3(30.17,31.19) 32.21,31.19 32.87,31.85 32.87,35.66 33.22,36.02 35.86,36.02 36.58,35.31 36.58,30.73
BOOT1: length 141.9
  Top Layer w0.203: 83.96,7.62 83.96,13.96 84.84,14.83 94.23,14.83 94.89,15.49 94.89,24.18 97.74,27.03 97.74,70.31 v3(97.64,70.41) ; 70.02,66.44 74.98,71.4 89.43,71.4 90.73,72.69 91.95,72.69 P1.36
  Bottom Layer w0.203: 78.54,94.19 79.95,95.61 90.02,95.61 90.63,95 90.63,73.2 90.83,73 P1.36 93.52,71.73 96.32,71.73 v3(97.64,70.41)
CAN_RX: length 23.2
  Top Layer w0.203: v3(21.49,61.77) 16.15,61.77 v3(16.1,61.72) ; v3(21.49,63.2) 20.88,63.8 v3(20.88,69.95)
  Bottom Layer w0.203: U3.4 20.9,69.98 v3(20.88,69.95) ; SW4.1 14.58,54.95 14.58,57.05 16.1,58.57 v3(16.1,61.72) ; v3(21.49,61.77) v3(21.49,63.2)
CAN_TX: length 23.1
  Top Layer w0.203: v2(23.06,59.84) 23.22,59.69 v3(23.22,57.05) ; v3(20.42,57.05) 20.09,56.72 19.75,56.72 arc(19.57,56.64) 19.39,56.72 17.86,58.24 arc(17.5,58.24) 17.5,57.89 19.03,56.36 arc(19.1,56.18) 19.03,56 SW4.6
  Bottom Layer w0.203: v3(23.22,57.05) v3(20.42,57.05) ; v2(23.06,59.84) 22.4,60.5 21.95,60.5 20.68,61.77 20.68,63.6 21.08,64.01 21.08,65.84 21.41,66.17 U3.1
CH340_D+: length 9.1
  Top Layer w0.254: 11.72,25.46 11.72,23.62 11.33,23.23 USB1.B6 6.83,23.23 6.61,23.45 6.61,23.99 6.86,24.25 7.87,24.25 USB1.A6
CH340_D-: length 8.6
  Top Layer w0.254: 9.02,24.73 USB1.B7 ; 9.02,24.73 9.54,24.73 11.45,26.64 12.4,26.64 12.72,26.31 12.72,25.46 ; 9.02,24.73 9.02,23.98 8.76,23.73 USB1.A7
D+: length 17.1
  Top Layer w0.254: USB2.A6 6.55,38.36 6.36,38.17 6.36,37.56 6.55,37.36 USB2.B6 9.81,37.36 10.02,37.57 R25.2 10.02,38.73 10.42,39.13 11.74,39.13 13.46,40.85 13.46,44.14 14.22,44.91 R47.1
D-: length 17.2
  Top Layer w0.254: 9.08,38.86 9.1,38.84 9.1,38.22 8.74,37.86 USB2.A7 ; 9.08,38.86 USB2.B7 ; 9.08,38.86 9.38,38.86 10.11,39.59 11.38,39.59 12.6,40.81 12.6,41.11 arc(12.55,41.24) 12.42,41.29 arc(12.3,41.35) 12.24,41.47 12.24,41.62 arc(12.3,41.75) 12.42,41.8 arc(12.55,41.85) 12.6,41.98 12.6,42.13 arc(12.55,42.26) 12.42,42.31 arc(12.3,42.36) 12.24,42.49 12.24,42.64 arc(12.3,42.76) 12.42,42.82 arc(12.55,42.87) 12.6,43 12.6,43.14 arc(12.55,43.27) 12.42,43.32 arc(12.3,43.38) 12.24,43.5 12.24,43.65 arc(12.3,43.78) 12.42,43.83 arc(12.55,43.89) 12.6,44.01 12.6,44.16 arc(12.55,44.29) 12.42,44.34 arc(12.3,44.39) 12.24,44.52 12.24,44.67 arc(12.3,44.8) 12.42,44.85 arc(12.55,44.9) 12.6,45.03 12.6,45.39 13.6,46.38 15.48,46.38
F_CS: length 54.6
  Top Layer w0.203: 62.31,86.23 60.38,86.23 59.33,85.19 59.33,84.98 arc(59.26,84.8) 59.08,84.73 58.93,84.73 arc(58.67,84.47) 58.93,84.22 59.08,84.22 arc(59.33,83.96) 59.08,83.71 58.93,83.71 arc(58.67,83.46) 58.93,83.2 59.08,83.2 arc(59.33,82.95) 59.08,82.69 58.93,82.69 arc(58.67,82.44) 58.93,82.19 59.08,82.19 arc(59.33,81.93) 59.08,81.68 58.93,81.68 arc(58.67,81.42) 58.93,81.17 59.08,81.17 arc(59.33,80.92) 59.08,80.66 58.93,80.66 arc(58.67,80.41) 58.93,80.15 59.08,80.15 arc(59.33,79.9) 59.08,79.65 58.93,79.65 arc(58.67,79.39) 58.93,79.14 59.08,79.14 arc(59.26,79.06) 59.33,78.88 59.33,78.72 arc(59.27,78.56) 59.11,78.49 arc(58.94,78.42) 58.88,78.26 58.88,78.21 arc(58.94,78.05) 59.11,77.98 arc(59.27,77.91) 59.33,77.75 59.33,74.27 59.13,74.07 58.86,74.07 U1.73 37.07,95.86 P2.53
FIFO_OE: length 68.8
  Top Layer w0.203: U1.132 40.31,37.44 P2.7
  Bottom Layer w0.203: P2.7 32.66,36.12 28.6,36.12 27.13,34.65 27.13,11.63 24.08,8.59 20.68,8.59 20.02,7.92 20.02,6.1 18.64,4.72 H2.7
FIFO_RCLK: length 108.9
  Top Layer w0.203: v2(27.18,40.69) 27.94,39.93 v2(28.85,39.93) ; U6.3 8.28,54.76 8.7,54.35 R31.2 11.79,54.35 12.19,53.95 12.19,47.95 12.39,47.75 13.92,47.75 14.17,47.5 v2(14.17,47.04) ; v2(18.85,41.55) v2(24.64,41.55) ; P2.5 v1(37.19,34.9) 39.19,34.9 U1.134
  Bottom Layer w0.203: v2(18.85,41.55) 15.14,41.55 14.17,42.52 v2(14.17,47.04) ; v2(24.64,41.55) 26.37,41.55 27.18,40.74 v2(27.18,40.69) ; H2.16 30.02,5.99 33.27,5.99 35.61,8.33 35.61,33.43 34.14,34.9 P2.5 ; v2(28.85,39.93) 30.07,38.71 35.61,38.71 37.19,37.13 37.19,35.05 37.08,34.95
FIFO_RRST: length 71.6
  Top Layer w0.203: 52.7,51.94 39.41,38.66 33.02,38.66 31.8,37.44 P2.8
  Bottom Layer w0.203: P2.8 28.7,37.44 26.57,35.31 26.57,11.89 23.93,9.25 17.68,9.25 17.32,8.89 17.32,5.99 H2.5
FIFO_WEN: length 118.2
  Top Layer w0.203: v2(11.68,46.99) 13.16,46.99 v2(13.21,47.04) ; v2(27.89,34.49) 24.49,34.49 v2(23.62,35.36) ; v2(8.84,63.8) 8.84,65.13 9.09,65.38 9.91,65.38 10.67,66.14 10.59,66.22 R35.2 ; U1.133 39.9,36.32 32.66,36.32 31.45,35.1 P2.6 ; U6.13 10.59,67.46
  Bottom Layer w0.203: v2(23.62,35.36) 23.62,38.91 23.27,39.27 13.92,39.27 13.46,39.73 13.46,46.79 v2(13.21,47.04) ; v2(11.68,46.99) 9.35,46.99 8.84,47.5 v2(8.84,63.8) ; H2.18 30.07,8.48 30.07,20.93 29.46,21.54 29.46,32.92 P2.6 31.14,35.2 29.06,35.2 28.35,34.49 v2(27.89,34.49)
FIFO_WRST: length 76.1
  Top Layer w0.203: P2.15 43.4,47.6 50.22,54.42
  Bottom Layer w0.203: P2.15 33.98,47.5 32.82,46.33 32.82,44.4 32.11,43.69 30.22,43.69 28.19,41.67 28.19,37.95 26.06,35.81 26.06,12.19 23.67,9.8 15.9,9.8 14.88,8.79 14.88,6.1 H2.3
FSMC_A10: length 84.9
  Top Layer w0.203: v1(44.55,90.07) 45.87,88.75 77.01,88.75 v1(77.83,87.93) ; U1.56 72.48,74.56 83.4,74.56 89.46,80.62 P1.42
  Bottom Layer w0.203: v1(87.73,78.84) 86.92,78.84 v1(77.83,87.93) ; v1(44.55,90.07) 44.55,95.25 1.2
FSMC_D0: length 56.3
  Top Layer w0.203: v1(54.86,69.7) 54.74,69.7 U1.85 51.59,72.85 50.99,72.85 40.68,83.16 P2.43
  Bottom Layer w0.203: v1(54.86,69.7) 54.86,72.49 49.28,78.08 49.28,95.61 1.6
FSMC_D1: length 58
  Top Layer w0.203: P2.42 31.65,80.62 32.97,81.94 41.4,81.94 50.9,72.44 51.29,72.44 U1.86 55.37,68.36 v1(55.37,68.28)
  Bottom Layer w0.203: v1(55.37,68.28) 55.37,72.64 50.7,77.32 1.7
FSMC_D2: length 69.4
  Top Layer w0.203: v1(51.05,59.94) 50.09,59.94 U1.114 45.27,55.13 34.08,55.13 P2.21
  Bottom Layer w0.203: v1(51.05,59.94) 54.66,63.55 55.52,63.55 56.85,62.23 59.89,62.23 61.21,63.55 61.21,64.16 55.93,69.45 55.93,72.7 51.97,76.66 51.97,95.45 1.8
FSMC_D3: length 70.7
  Top Layer w0.203: P2.20 31.45,52.73 32.46,53.75 44.5,53.75 44.55,53.7 U1.115 49.88,59.03 v1(51.36,59.03)
  Bottom Layer w0.203: 1.9 53.24,76 56.29,72.95 56.29,69.6 61.77,64.11 61.77,63.4 60.15,61.77 56.44,61.77 55.12,63.09 54.71,63.09 51.56,59.94 51.56,59.69 51.36,59.49 v1(51.36,59.03)
FSMC_D4: length 73.3
  Top Layer w0.203: P1.44 91.9,83.52 91.54,83.16 89.97,83.16 82.16,75.35 71.86,75.35 U1.58 65.33,68.82 v1(65.33,67.51)
  Bottom Layer w0.203: 1.10 54.2,95.76 54.2,75.79 56.59,73.41 56.59,70.21 60.55,66.24 64.06,66.24 v1(65.33,67.51)
FSMC_D5: length 72.2
  Top Layer w0.203: v1(64.67,67.61) 64.67,68.86 U1.59 71.66,75.85 81.69,75.85 90.12,84.28 93.67,84.28 94.79,83.16
  Bottom Layer w0.203: v1(64.67,67.61) 63.7,66.65 60.71,66.65 56.95,70.41 56.95,73.61 55.78,74.78 1.11
FSMC_D6: length 71.5
  Top Layer w0.203: v1(64.01,67.82) 64.01,68.91 U1.60 71.38,76.28 81.21,76.28 90.58,85.65 92.2,85.65 P1.46
  Bottom Layer w0.203: 1.12 56.95,95.56 56.95,74.17 57.35,73.76 57.35,70.61 60.91,67.06 63.25,67.06 v1(64.01,67.82)
FSMC_D7: length 72.4
  Top Layer w0.203: v1(63.4,68.07) 63.4,70.42 U1.63 69.73,76.76 80.72,76.76 90.93,86.97 93.73,86.97 94.79,85.9 94.79,85.7
  Bottom Layer w0.203: 1.13 57.4,93.28 57.4,74.32 57.76,73.96 57.76,70.81 61.06,67.51 62.84,67.51 v1(63.4,68.07)
FSMC_D8: length 71.7
  Top Layer w0.203: v1(62.84,68.43) 62.84,70.57 U1.64 69.48,77.22 80.16,77.22 91.08,88.14 92.15,88.14 P1.48
  Bottom Layer w0.203: 1.14 59.17,95.88 59.17,93.46 57.86,92.15 57.86,74.52 58.11,74.27 58.11,70.97 61.01,68.07 62.48,68.07 v1(62.84,68.43)
FSMC_D9: length 71.6
  Top Layer w0.203: 94.79,88.24 93.42,89.61 91.49,89.61 79.6,77.72 69.28,77.72 62.28,70.72 v1(62.28,69.04)
  Bottom Layer w0.203: 1.15 58.42,91.75 58.42,71.27 61.01,68.68 61.92,68.68 v1(62.28,69.04)
FSMC_D10: length 71.2
  Top Layer w0.203: v1(61.57,69.19) 61.92,69.55 61.92,71.07 63.66,72.8 ; P1.50 92.2,90.83 91.08,90.83 78.4,78.15 69,78.15 63.66,72.8
  Bottom Layer w0.203: v1(61.57,69.19) 61.06,69.19 58.88,71.37 58.88,90.68 61.92,93.73 61.92,95.66 1.16
FSMC_D11: length 70.8
  Top Layer w0.203: v1(61.16,69.9) 61.32,70.05 61.32,71.17 U1.67 68.69,78.54 77.83,78.54 91.49,92.2 93.37,92.2 94.79,90.78
  Bottom Layer w0.203: v1(61.16,69.9) 59.33,71.73 59.33,90.02 63.4,94.08 1.17
FSMC_D12: length 68.7
  Top Layer w0.203: P1.52 91.29,93.32 v1(79.3,81.33) 77.02,79.05 68.49,79.05 62.95,73.51
  Bottom Layer w0.203: 1.18 64.3,97.64 69.19,97.64 69.8,97.03 69.8,82.85 71.32,81.33 79.15,81.33
FSMC_D13: length 58.9
  Top Layer w0.203: P2.49 39.31,90.78 49.07,81.02 49.07,81.02 U1.77 57.91,72.19 59.94,72.19 v1(60.1,72.34)
  Bottom Layer w0.203: v1(60.1,72.34) 60.1,89.66 63.6,93.17 64.91,93.17 1.19
FSMC_D14: length 63.6
  Top Layer w0.203: P2.48 32.66,89.46 v1(39.01,89.46) 39.93,89.46 U1.78 ; v1(43.59,92.25) 64.26,92.25 64.62,92.61 64.62,95.41 1.20
  Bottom Layer w0.203: v1(39.01,89.46) 41.81,92.25 v1(43.59,92.25)
FSMC_D15: length 61.9
  Top Layer w0.203: P2.47 40.44,88.24 U1.79 56.9,71.78 60.86,71.78 v1(61.67,72.59)
  Bottom Layer w0.203: v1(61.67,72.59) 60.6,73.66 60.6,89.31 64.11,92.81 67.1,92.81 1.21
FSMC_NE4: length 88.7
  Top Layer w0.203: U1.127 40.44,41.1 32.87,41.1 31.75,39.98 P2.10
  Bottom Layer w0.203: 1.1 40.09,94.19 38.25,92.35 38.25,45.21 36.93,43.89 33.43,43.89 32.77,43.23 32.77,41.25 31.5,39.98 P2.10
FSMC_NOE: length 63.6
  Top Layer w0.203: v1(50.39,57.45) 50.39,57.42 U1.118 43.11,50.14 P2.17
  Bottom Layer w0.203: 1.4 46.99,95.36 46.99,78.94 53.85,72.09 53.85,65.48 50.39,62.03 v1(50.39,57.45)
FSMC_NWE: length 70.2
  Top Layer w0.203: U1.119 42.5,48.82 v1(40.49,48.82) 32.66,48.82 P2.16
  Bottom Layer w0.203: 40.49,48.92 40.49,64.77 47.8,72.09 47.8,77.22 45.62,79.4 1.3
GBC_KEY: length 37.7
  Top Layer w0.203: P1.28 90.33,62.84 arc(90.15,62.77) 90.08,62.59 90.08,62.33 arc(89.82,62.08) 89.57,62.33 89.57,62.59 arc(89.32,62.84) 89.06,62.59 89.06,62.33 arc(88.81,62.08) 88.55,62.33 88.55,62.59 arc(88.3,62.84) 88.05,62.59 88.05,62.33 arc(87.79,62.08) 87.54,62.33 87.54,62.59 arc(87.46,62.77) 87.28,62.84 86.87,62.84 86.18,63.53 arc(86,63.6) 85.82,63.53 85.76,63.46 arc(85.4,63.46) 85.4,63.82 85.46,63.89 arc(85.46,64.25) 85.1,64.25 85.04,64.18 arc(84.68,64.18) 84.68,64.54 84.74,64.6 arc(84.74,64.96) 84.38,64.96 84.32,64.9 arc(83.96,64.9) 83.96,65.26 84.02,65.32 arc(84.03,65.68) 83.67,65.68 83.6,65.62 arc(83.24,65.62) 83.24,65.98 83.31,66.04 arc(83.31,66.4) 82.95,66.4 82.88,66.34 arc(82.52,66.34) 82.52,66.7 82.59,66.76 arc(82.66,66.94) 82.59,67.12 82.26,67.45 81.3,67.45 arc(81.12,67.37) 81.05,67.19 81.05,66.9 arc(80.79,66.65) 80.54,66.9 80.54,67.19 arc(80.29,67.45) 80.03,67.19 80.03,66.9 arc(79.78,66.65) 79.52,66.9 79.52,67.19 arc(79.27,67.45) 79.02,67.19 79.02,66.9 arc(78.76,66.65) 78.51,66.9 78.51,67.19 arc(78.25,67.45) 78,67.19 78,66.9 arc(77.75,66.65) 77.49,66.9 77.49,67.19 arc(77.24,67.45) 76.98,67.19 76.98,66.9 arc(76.73,66.65) 76.48,66.9 76.48,67.19 arc(76.4,67.37) 76.22,67.45 75.44,66.66 arc(75.36,66.48) 75.44,66.3 75.82,65.92 arc(75.82,65.56) 75.46,65.56 75.08,65.94 arc(74.9,66.01) 74.72,65.94 74.39,65.61 74.39,65.15 U1.40
GBC_LED: length 43.1
  Top Layer w0.203: U6.5 8.74,57.3 8.99,57.56 9,57.55 R32.2 11.93,57.55 14.83,60.45 27.48,60.45 28.91,59.03 32.71,59.03 P2.25 34.19,60.3 36.73,57.76 45.13,57.76 45.98,58.61 U1.110
GBC_RX: length 41.2
  Top Layer w0.203: U1.69 68.25,79.51 76.21,79.51 91.19,94.49 93.57,94.49 94.74,93.32 94.79,93.32
GBC_TX: length 39
  Top Layer w0.203: P1.54 91.59,95.86 75.71,79.98 68.01,79.98 U1.70
IIC_SCL: length 39.7
  Top Layer w0.203: P2.3 34.04,32.31 38.01,32.31 U1.136
  Top Layer w0.254: v3(42.32,33.43) 42.93,34.04 v3(43.89,34.04)
  Bottom Layer w0.203: v3(37.34,32.26) 38.51,33.43 v3(42.32,33.43)
  Bottom Layer w0.254: U5.6 46.3,33.6 45.99,33.29 44.64,33.29 v3(43.89,34.04)
IIC_SDA: length 44.7
  Top Layer w0.203: v3(39.52,30.58) 40.39,31.45 v3(46.43,31.45) ; P2.2 31.45,30.28 32.47,31.31 v3(37.22,31.31) 37.72,31.31 U1.137
  Bottom Layer w0.203: 37.29,31.24 37.95,30.58 v3(39.52,30.58)
  Bottom Layer w0.254: v3(46.43,31.45) 46.79,31.09 47.54,31.09 ; 47.54,31.09 47.49,31.04 ; 47.54,31.09 U5.5
JTCK: length 41.9
  Top Layer w0.203: U1.109 44.93,58.32 38,58.32 34.8,61.52 32.66,61.52 P2.26 31.39,60.35 29.87,60.35 27.83,62.39 R34.2 6.77,62.39 U6.9
JTMS: length 43.5
  Top Layer w0.203: U1.105 44.21,66.09 39.83,66.09 36.58,62.84 P2.27 ; v1(28.24,60.96) 13.61,60.96 13.15,60.49 R33.2 8.99,60.49 8.34,59.84 U6.7
  Bottom Layer w0.203: v1(28.24,60.96) 28.85,61.57 32.71,61.57 P2.27
KEY0: length 61.8
  Top Layer w0.203: v3(94.03,16.71) 93.97,16.65 93.1,16.65 ; v3(96.52,16.76) 97.49,16.76 97.6,16.65 ; v3(96.16,26.82) 96.16,33.53 94.79,34.9 93.47,36.22 91.9,36.22 91.08,35.41 74.18,35.41 U1.3
  Bottom Layer w0.203: v3(94.03,16.71) 94.08,16.76 v3(96.52,16.76) 96.52,26.47 v3(96.16,26.82)
KEY1: length 65.9
  Top Layer w0.203: v3(93.62,27.08) 93.62,27.13 91.95,25.45 v3(91.95,16.05) ; P1.6 73.98,34.9 72.63,36.25 ; 72.63,36.25 72.63,36.19 ; 72.63,36.25 U1.2 ; SW7.4 SW7.3 92.31,11.32 91.9,11.73 v3(91.9,12.9)
  Bottom Layer w0.203: v3(93.62,27.08) 93.62,33.53 P1.6 ; v3(91.95,16.05) 91.95,12.95 v3(91.9,12.9)
KEY2: length 74.1
  Top Layer w0.203: SW8.4 SW8.3 93.09,6.71 v3(91.44,6.71) ; U1.1 74.7,33.48 93.67,33.48 94.79,32.36 ; v3(95.35,27.94) v3(95.35,25.91)
  Bottom Layer w0.203: v3(95.35,25.91) 95.35,24.64 90.98,20.27 90.98,7.16 v3(91.44,6.71) ; v3(95.35,27.94) 96.21,28.8 96.21,30.94 94.79,32.36
LCD_BL: length 63.6
  Top Layer w0.203: U1.46 70.73,65.75 75.29,70.31 87.83,70.31 88.34,69.8 v1(88.8,69.8) 91.59,69.8 P1.34
  Bottom Layer w0.203: v1(88.8,69.8) 88.8,89.87 87.27,91.39 73.82,91.39 1.23
LED0: length 64.6
  Top Layer w0.203: v3(27.13,9.45) 26.67,9.45 24.98,7.76 LED1.2 ; 54.82,49.82 38.63,33.63 32.71,33.63 P2.4 31.45,31.54 29.31,29.41 29.31,19.91 28.65,19.25 v3(28.65,18.34)
  Bottom Layer w0.203: v3(27.13,9.45) 28.65,10.97 v3(28.65,18.34)
LED1: length 85.7
  Top Layer w0.203: v3(75.23,6.65) 75.23,1.28 LED2.2 ; 73.17,37.13 74.28,36.02 90.68,36.02 92.1,37.44 P1.8 ; 73.17,37.13 73.17,37.09 ; 73.17,37.13 U1.4 ; v3(84.38,25.35) 84.38,22.61 v3(84.28,22.5)
  Bottom Layer w0.203: v3(75.23,6.65) 75.23,20.73 76.2,21.69 83.46,21.69 v3(84.28,22.5) ; P1.8 86.92,37.44 84.38,34.9 v3(84.38,25.35)
LIGHT_SENSOR: length 117.3
  Top Layer w0.203: v2(35.92,61.87) 36.63,61.16 46.99,61.16 v2(47.09,61.06) ; v2(23.42,94.08) 23.43,94.09 R17.1 ; v2(30.07,76.91) 24.89,76.91 v2(24.08,77.72) ; v2(56.64,53.39) 56.67,53.36 63.01,53.36 65.23,55.58 66.04,55.58 U1.20 71.93,49.68 75.81,49.68 80.48,45.01 83.16,45.01 89.36,51.21 93.73,51.21 94.79,50.14
  Bottom Layer w0.203: v2(24.08,77.72) 23.42,78.38 v2(23.42,94.08) ; v2(47.09,61.06) 48.87,59.28 48.87,58.22 53.7,53.39 v2(56.64,53.39) ; v2(30.07,76.91) 36.12,76.91 36.68,76.35 36.68,68.73 35.61,67.67 35.61,62.18 v2(35.92,61.87)
NRF_CE: length 36.4
  Top Layer w0.203: U1.93 45.78,73 P2.35
  Bottom Layer w0.203: P2.35 32.82,74.17 29.67,74.17 29.21,74.62 29.21,84.18 U2.4
NRF_CS: length 40.6
  Top Layer w0.203: 51.28,68.21 49.53,69.96 49.35,69.96 45.04,74.27 32.71,74.27 P2.36
  Bottom Layer w0.203: U2.3 26.31,84.53 26.31,74.37 27.69,73 P2.36
NRF_IRQ: length 55.3
  Top Layer w0.203: U2.7 23.32,89.26 23.32,75.79 24.89,74.22 31.7,74.22 33.02,75.54 P2.37 35.89,75.54 arc(36.07,75.47) 36.14,75.29 36.14,75.13 arc(36.4,74.88) 36.65,75.13 36.65,75.29 arc(36.91,75.54) 37.16,75.29 37.16,75.13 arc(37.42,74.88) 37.67,75.13 37.67,75.29 arc(37.92,75.54) 38.18,75.29 38.18,75.13 arc(38.43,74.88) 38.69,75.13 38.69,75.29 arc(38.94,75.54) 39.19,75.29 39.19,75.13 arc(39.45,74.88) 39.7,75.13 39.7,75.29 arc(39.95,75.54) 40.21,75.29 40.21,75.13 arc(40.46,74.88) 40.72,75.13 40.72,75.29 arc(40.97,75.54) 41.23,75.29 41.23,75.13 arc(41.48,74.88) 41.73,75.13 41.73,75.29 arc(41.99,75.54) 42.24,75.29 42.24,75.13 arc(42.49,74.88) 42.75,75.13 42.75,75.29 arc(43,75.54) 43.26,75.29 43.26,75.13 arc(43.51,74.88) 43.77,75.13 43.77,75.29 arc(43.84,75.47) 44.02,75.54 44.35,75.54 49.57,70.32 49.88,70.32 U1.91
OV_D0: length 116.8
  Top Layer w0.203: H2.8 22.91,11.58 42.32,11.58 59.28,28.55 v3(59.28,33.32) ; P1.22 83.49,55.22 82.65,56.06 81,56.06 77.06,52.12 73.73,52.12 U1.26 68.94,56.92 68.94,57.1 v3(67.11,58.93)
  Bottom Layer w0.203: v3(59.28,33.32) 59.08,33.53 59.08,56.79 61.21,58.93 v3(67.11,58.93)
OV_D1: length 143.2
  Top Layer w0.203: 94.79,55.22 93.57,56.44 90.63,56.44 90.58,56.39 83.97,56.39 83.76,56.6 80.96,56.6 76.84,52.48 74.08,52.48 U1.27
  Bottom Layer w0.203: 94.79,55.22 96.88,53.14 96.88,28.65 92,23.77 64.16,23.77 42.27,1.88 23.98,1.88 H2.9
OV_D2: length 114.1
  Top Layer w0.203: H2.10 24.84,10.97 42.42,10.97 60.35,28.91 v3(60.35,33.58) ; P1.24 83.78,57.76 83.05,57.03 80.8,57.03 76.61,52.83 74.44,52.83 71.08,56.19 68.39,58.88 v3(68.12,58.88)
  Bottom Layer w0.203: v3(68.12,58.88) 67.11,57.86 61.11,57.86 59.69,56.44 59.69,34.24 v3(60.35,33.58)
OV_D3: length 127.8
  Top Layer w0.203: 94.79,57.76 94.79,58.17 93.98,58.98 82.12,58.98 76.38,53.24 74.74,53.24 U1.29 71.43,56.54 v3(68.07,59.89)
  Bottom Layer w0.203: v3(68.07,59.89) 68.07,61.98 66.95,63.09 64.67,63.09 58.62,57.05 58.62,19.1 41.96,2.44 25.96,2.44 H2.11
OV_D4: length 111
  Top Layer w0.203: H2.12 26.67,10.26 42.32,10.26 61.06,29.01 v3(61.06,32.46) ; v3(66.75,60.91) 67.32,60.91 U1.44 75.87,69.46 86.24,69.46 87.83,67.87 92.2,67.87 P1.32 ; v3(64.36,59.54) 64.36,58.67 v3(62.79,57.1)
  Bottom Layer w0.203: v3(66.75,60.91) 65.38,59.54 v3(64.36,59.54) ; v3(61.06,32.46) 61.06,55.37 v3(62.79,57.1)
OV_D5: length 120
  Top Layer w0.203: 94.79,67.92 93.62,69.09 87.68,69.09 86.88,69.89 75.59,69.89 U1.45 69.46,63.75 v3(68.33,63.75)
  Bottom Layer w0.203: H2.13 27.99,2.95 41.55,2.95 58.17,19.56 58.17,57.35 64.57,63.75 v3(68.33,63.75)
OV_D6: length 110.4
  Top Layer w0.203: P2.34 31.45,70.92 32.21,71.68 44.98,71.68 U1.96 56.85,59.82 58.85,59.82 v3(62.64,56.03) ; v3(61.82,33.17) 61.82,29.01 42.21,9.4 28.35,9.4 H2.14
  Bottom Layer w0.203: v3(62.64,56.03) 61.82,55.22 v3(61.82,33.17)
OV_D7: length 103.2
  Top Layer w0.203: P2.33 45.49,70.46 U1.97 54.15,61.8 v1(54.15,61.72)
  Bottom Layer w0.203: H2.15 30.02,3.45 40.95,3.45 57.71,20.22 57.71,58.17 v1(54.15,61.72)
OV_SCL: length 76.2
  Top Layer w0.203: 48.45,56.19 43.73,51.46 33.07,51.46 31.75,50.14 P2.18 29.57,48.26 29.57,39.47 28.5,38.4 28.5,20.47 17.58,9.55 15.49,9.55 13.61,7.67 13.61,7.37 H2.4 12.34,6.1 12.34,2.75 12.44,2.66
OV_SDA: length 70.6
  Top Layer w0.203: R46.1 17.43,5.88 H2.6 28.91,20.12 28.91,37.8 29.97,38.86 32.23,38.86 33.35,39.98 P2.9 40.03,39.98 U1.128
OV_VSYNC: length 101.2
  Top Layer w0.203: P2.30 31.45,65.73 32.14,66.43 34.02,66.43 35.76,68.17 45.66,68.17 U1.100 48.46,65.38 v1(53.19,60.66)
  Bottom Layer w0.203: v1(53.19,60.66) 57.3,56.54 57.3,20.78 40.39,3.86 32.16,3.86 H2.17
PA0: length 69.4
  Top Layer w0.203: v3(97.64,23.06) 97.64,22.13 SW5.4 95.87,21.99 v3(95.81,22.05) ; SW5.3 94.04,21.99 v3(94.08,21.95) ; P1.26 91.49,60.3 90.63,59.44 82.04,59.44 77.37,54.76 76.75,54.76 U1.34
  Bottom Layer w0.203: v3(97.64,23.06) 97.64,57.35 95.96,59.03 93.73,59.03 92.46,60.3 P1.26 ; v3(95.81,22.05) 95.71,21.95 v3(94.08,21.95)
